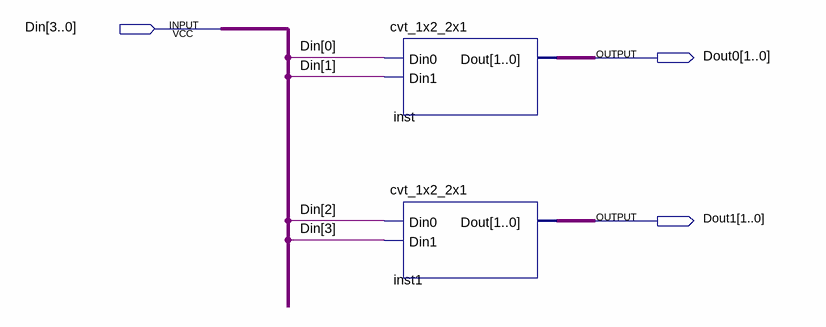
[diagram p0: schematic sheet]
// Quartus schematic cvt_4x1_2x2.bdf as structural Verilog: 2 symbols, 3 pins
module cvt_4x1_2x2 (
  input  [3:0] Din,
  output [1:0] Dout0,
  output [1:0] Dout1
);

  cvt_1x2_2x1 inst (.Din0(Din[0]), .Din1(Din[1]), .Dout(Dout0));
  cvt_1x2_2x1 inst1 (.Din0(Din[2]), .Din1(Din[3]), .Dout(Dout1));
endmodule
